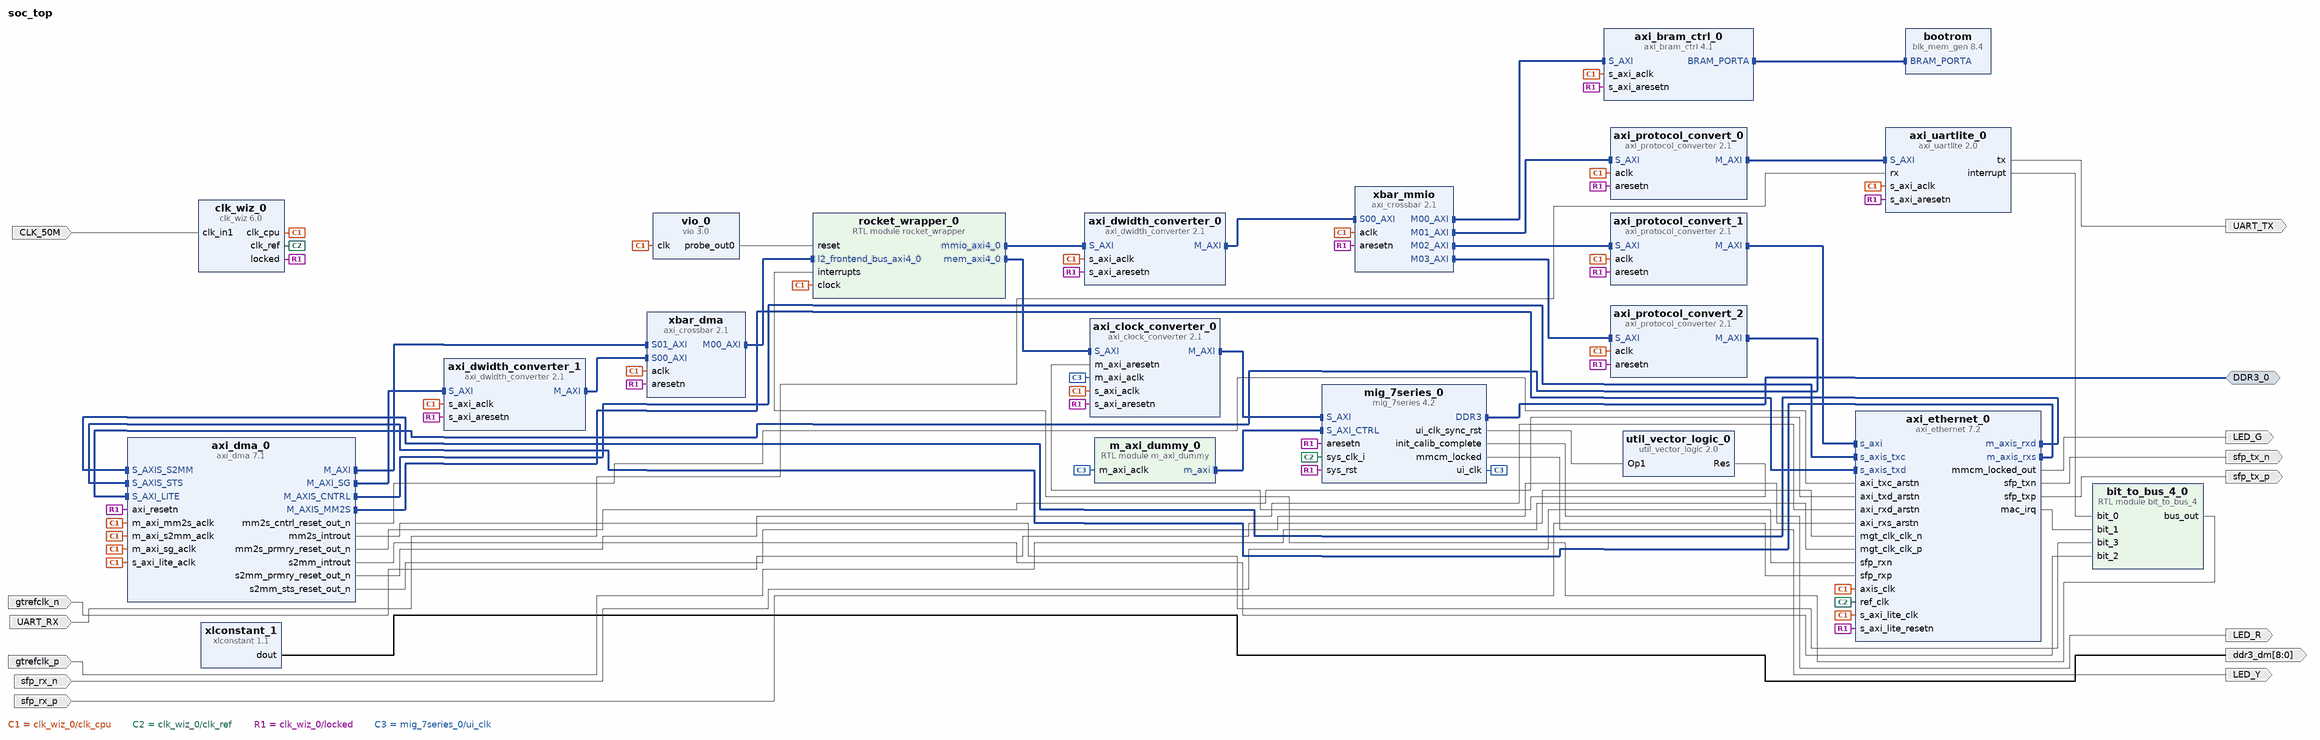
[diagram p0: block diagram of the top level]
# Vivado block design soc_top, xc7k325tffg900-2, Vivado 2021.2.1
create_bd_design soc_top

create_bd_intf_port -mode Master -vlnv xilinx.com:interface:ddrx_rtl:1.0 DDR3_0
create_bd_port -dir O sfp_tx_p
create_bd_port -dir O sfp_tx_n
create_bd_port -dir I sfp_rx_p
create_bd_port -dir I sfp_rx_n
create_bd_port -dir I -type clk gtrefclk_p
set_property -dict {CONFIG.FREQ_HZ 125000000} [get_bd_ports gtrefclk_p]
create_bd_port -dir I -type clk gtrefclk_n
set_property -dict {CONFIG.FREQ_HZ 125000000} [get_bd_ports gtrefclk_n]
create_bd_port -dir O LED_R
create_bd_port -dir O LED_Y
create_bd_port -dir O LED_G
create_bd_port -dir I -type clk CLK_50M
set_property -dict {CONFIG.FREQ_HZ 50000000} [get_bd_ports CLK_50M]
create_bd_port -dir I UART_RX
create_bd_port -dir O UART_TX
create_bd_port -dir O -from 8 -to 0 ddr3_dm

create_bd_cell -type ip -vlnv xilinx.com:ip:axi_ethernet:7.2 axi_ethernet_0
set_property -dict [list \
  CONFIG.Frame_Filter true \
  CONFIG.PHY_TYPE 1000BaseX \
  CONFIG.Statistics_Counters true \
  CONFIG.axiliteclkrate 100 \
  CONFIG.axisclkrate 100 \
  CONFIG.processor_mode true \
] [get_bd_cells axi_ethernet_0]
create_bd_cell -type ip -vlnv xilinx.com:ip:clk_wiz:6.0 clk_wiz_0
set_property -dict [list \
  CONFIG.CLKIN1_JITTER_PS 200.0 \
  CONFIG.CLKOUT1_JITTER 142.107 \
  CONFIG.CLKOUT1_PHASE_ERROR 164.985 \
  CONFIG.CLKOUT1_REQUESTED_OUT_FREQ 200.000 \
  CONFIG.CLKOUT2_JITTER 162.035 \
  CONFIG.CLKOUT2_PHASE_ERROR 164.985 \
  CONFIG.CLKOUT2_REQUESTED_OUT_FREQ 100 \
  CONFIG.CLKOUT2_USED true \
  CONFIG.CLK_OUT1_PORT clk_ref \
  CONFIG.CLK_OUT2_PORT clk_cpu \
  CONFIG.MMCM_CLKFBOUT_MULT_F 20.000 \
  CONFIG.MMCM_CLKIN1_PERIOD 20.000 \
  CONFIG.MMCM_CLKIN2_PERIOD 10.0 \
  CONFIG.MMCM_CLKOUT0_DIVIDE_F 5.000 \
  CONFIG.MMCM_CLKOUT1_DIVIDE 10 \
  CONFIG.NUM_OUT_CLKS 2 \
  CONFIG.PRIM_IN_FREQ 50 \
  CONFIG.USE_RESET false \
] [get_bd_cells clk_wiz_0]
create_bd_cell -type ip -vlnv xilinx.com:ip:axi_clock_converter:2.1 axi_clock_converter_0
create_bd_cell -type ip -vlnv xilinx.com:ip:axi_crossbar:2.1 xbar_mmio
set_property -dict {CONFIG.DATA_WIDTH 32 CONFIG.NUM_MI 4} [get_bd_cells xbar_mmio]
create_bd_cell -type ip -vlnv xilinx.com:ip:axi_bram_ctrl:4.1 axi_bram_ctrl_0
set_property -dict {CONFIG.DATA_WIDTH 32 CONFIG.SINGLE_PORT_BRAM 1} [get_bd_cells axi_bram_ctrl_0]
create_bd_cell -type ip -vlnv xilinx.com:ip:axi_uartlite:2.0 axi_uartlite_0
set_property -dict {CONFIG.C_BAUDRATE 115200} [get_bd_cells axi_uartlite_0]
create_bd_cell -type ip -vlnv xilinx.com:ip:axi_dma:7.1 axi_dma_0
set_property -dict [list \
  CONFIG.c_addr_width 32 \
  CONFIG.c_include_mm2s_dre 1 \
  CONFIG.c_include_s2mm_dre 1 \
  CONFIG.c_m_axi_mm2s_data_width 64 \
  CONFIG.c_m_axi_s2mm_data_width 64 \
  CONFIG.c_mm2s_burst_size 8 \
  CONFIG.c_s2mm_burst_size 8 \
  CONFIG.c_single_interface 1 \
] [get_bd_cells axi_dma_0]
create_bd_cell -type ip -vlnv xilinx.com:ip:axi_protocol_converter:2.1 axi_protocol_convert_0
create_bd_cell -type ip -vlnv xilinx.com:ip:axi_protocol_converter:2.1 axi_protocol_convert_1
create_bd_cell -type ip -vlnv xilinx.com:ip:axi_protocol_converter:2.1 axi_protocol_convert_2
create_bd_cell -type ip -vlnv xilinx.com:ip:axi_dwidth_converter:2.1 axi_dwidth_converter_0
create_bd_cell -type ip -vlnv xilinx.com:ip:vio:3.0 vio_0
set_property -dict [list \
  CONFIG.C_NUM_PROBE_IN 0 \
  CONFIG.C_NUM_PROBE_OUT 1 \
  CONFIG.C_PROBE_OUT0_INIT_VAL 0x1 \
  CONFIG.C_PROBE_OUT1_INIT_VAL 0x1 \
] [get_bd_cells vio_0]
create_bd_cell -type ip -vlnv xilinx.com:ip:mig_7series:4.2 mig_7series_0
set_property -dict [list \
  CONFIG.BOARD_MIG_PARAM Custom \
  CONFIG.MIG_DONT_TOUCH_PARAM Custom \
  CONFIG.RESET_BOARD_INTERFACE Custom \
  CONFIG.XML_INPUT_FILE mig_a.prj \
] [get_bd_cells mig_7series_0]
create_bd_cell -type ip -vlnv xilinx.com:ip:util_vector_logic:2.0 util_vector_logic_0
set_property -dict {CONFIG.C_OPERATION not CONFIG.C_SIZE 1} [get_bd_cells util_vector_logic_0]
create_bd_cell -type ip -vlnv xilinx.com:ip:xlconstant:1.1 xlconstant_1
set_property -dict {CONFIG.CONST_VAL 0 CONFIG.CONST_WIDTH 9} [get_bd_cells xlconstant_1]
create_bd_cell -type module -reference m_axi_dummy m_axi_dummy_0
create_bd_cell -type module -reference bit_to_bus_4 bit_to_bus_4_0
create_bd_cell -type ip -vlnv xilinx.com:ip:blk_mem_gen:8.4 bootrom
set_property -dict [list \
  CONFIG.Coe_File ../../../../../../../u-boot/u-boot.coe \
  CONFIG.EN_SAFETY_CKT false \
  CONFIG.Enable_32bit_Address true \
  CONFIG.Fill_Remaining_Memory_Locations true \
  CONFIG.Load_Init_File true \
  CONFIG.Read_Width_A 32 \
  CONFIG.Register_PortA_Output_of_Memory_Primitives false \
  CONFIG.Use_RSTA_Pin true \
  CONFIG.Write_Depth_A 65536 \
  CONFIG.Write_Width_A 32 \
  CONFIG.use_bram_block Stand_Alone \
] [get_bd_cells bootrom]
create_bd_cell -type module -reference rocket_wrapper rocket_wrapper_0
create_bd_cell -type ip -vlnv xilinx.com:ip:axi_dwidth_converter:2.1 axi_dwidth_converter_1
create_bd_cell -type ip -vlnv xilinx.com:ip:axi_crossbar:2.1 xbar_dma
set_property -dict [list \
  CONFIG.ADDR_RANGES 1 \
  CONFIG.DATA_WIDTH 64 \
  CONFIG.M00_A00_ADDR_WIDTH 32 \
  CONFIG.M00_A00_BASE_ADDR 0x0000000000000000 \
  CONFIG.NUM_MI 1 \
  CONFIG.NUM_SI 2 \
] [get_bd_cells xbar_dma]

# ---- connections ----

connect_bd_intf_net [get_bd_intf_pins axi_bram_ctrl_0/BRAM_PORTA] [get_bd_intf_pins bootrom/BRAM_PORTA]
connect_bd_intf_net [get_bd_intf_pins mig_7series_0/S_AXI] [get_bd_intf_pins axi_clock_converter_0/M_AXI]
connect_bd_intf_net [get_bd_intf_pins axi_dma_0/M_AXI] [get_bd_intf_pins xbar_dma/S01_AXI]
connect_bd_intf_net [get_bd_intf_pins axi_dma_0/M_AXIS_CNTRL] [get_bd_intf_pins axi_ethernet_0/s_axis_txc]
connect_bd_intf_net [get_bd_intf_pins axi_dma_0/M_AXIS_MM2S] [get_bd_intf_pins axi_ethernet_0/s_axis_txd]
connect_bd_intf_net [get_bd_intf_pins axi_dma_0/M_AXI_SG] [get_bd_intf_pins axi_dwidth_converter_1/S_AXI]
connect_bd_intf_net [get_bd_intf_pins xbar_mmio/S00_AXI] [get_bd_intf_pins axi_dwidth_converter_0/M_AXI]
connect_bd_intf_net [get_bd_intf_pins axi_dwidth_converter_1/M_AXI] [get_bd_intf_pins xbar_dma/S00_AXI]
connect_bd_intf_net [get_bd_intf_pins axi_dma_0/S_AXIS_S2MM] [get_bd_intf_pins axi_ethernet_0/m_axis_rxd]
connect_bd_intf_net [get_bd_intf_pins axi_ethernet_0/m_axis_rxs] [get_bd_intf_pins axi_dma_0/S_AXIS_STS]
connect_bd_intf_net [get_bd_intf_pins axi_protocol_convert_0/M_AXI] [get_bd_intf_pins axi_uartlite_0/S_AXI]
connect_bd_intf_net [get_bd_intf_pins axi_protocol_convert_1/M_AXI] [get_bd_intf_pins axi_ethernet_0/s_axi]
connect_bd_intf_net [get_bd_intf_pins axi_protocol_convert_2/M_AXI] [get_bd_intf_pins axi_dma_0/S_AXI_LITE]
connect_bd_intf_net [get_bd_intf_pins m_axi_dummy_0/m_axi] [get_bd_intf_pins mig_7series_0/S_AXI_CTRL]
connect_bd_intf_net [get_bd_intf_ports DDR3_0] [get_bd_intf_pins mig_7series_0/DDR3]
connect_bd_intf_net [get_bd_intf_pins rocket_wrapper_0/mem_axi4_0] [get_bd_intf_pins axi_clock_converter_0/S_AXI]
connect_bd_intf_net [get_bd_intf_pins axi_dwidth_converter_0/S_AXI] [get_bd_intf_pins rocket_wrapper_0/mmio_axi4_0]
connect_bd_intf_net [get_bd_intf_pins xbar_dma/M00_AXI] [get_bd_intf_pins rocket_wrapper_0/l2_frontend_bus_axi4_0]
connect_bd_intf_net [get_bd_intf_pins axi_bram_ctrl_0/S_AXI] [get_bd_intf_pins xbar_mmio/M00_AXI]
connect_bd_intf_net [get_bd_intf_pins axi_protocol_convert_0/S_AXI] [get_bd_intf_pins xbar_mmio/M01_AXI]
connect_bd_intf_net [get_bd_intf_pins xbar_mmio/M02_AXI] [get_bd_intf_pins axi_protocol_convert_1/S_AXI]
connect_bd_intf_net [get_bd_intf_pins xbar_mmio/M03_AXI] [get_bd_intf_pins axi_protocol_convert_2/S_AXI]
connect_bd_net [get_bd_ports CLK_50M] [get_bd_pins clk_wiz_0/clk_in1]
connect_bd_net [get_bd_pins axi_dma_0/mm2s_cntrl_reset_out_n] [get_bd_pins axi_ethernet_0/axi_txc_arstn]
connect_bd_net [get_bd_pins axi_dma_0/mm2s_introut] [get_bd_pins bit_to_bus_4_0/bit_3]
connect_bd_net [get_bd_pins axi_dma_0/mm2s_prmry_reset_out_n] [get_bd_pins axi_ethernet_0/axi_txd_arstn]
connect_bd_net [get_bd_pins axi_dma_0/s2mm_introut] [get_bd_pins bit_to_bus_4_0/bit_2]
connect_bd_net [get_bd_pins axi_dma_0/s2mm_prmry_reset_out_n] [get_bd_pins axi_ethernet_0/axi_rxd_arstn]
connect_bd_net [get_bd_pins axi_dma_0/s2mm_sts_reset_out_n] [get_bd_pins axi_ethernet_0/axi_rxs_arstn]
connect_bd_net [get_bd_pins axi_ethernet_0/mac_irq] [get_bd_pins bit_to_bus_4_0/bit_1]
connect_bd_net [get_bd_pins axi_ethernet_0/mmcm_locked_out] [get_bd_ports LED_G]
connect_bd_net [get_bd_pins axi_ethernet_0/sfp_txn] [get_bd_ports sfp_tx_n]
connect_bd_net [get_bd_pins axi_ethernet_0/sfp_txp] [get_bd_ports sfp_tx_p]
connect_bd_net [get_bd_pins axi_uartlite_0/interrupt] [get_bd_pins bit_to_bus_4_0/bit_0]
connect_bd_net [get_bd_pins axi_uartlite_0/tx] [get_bd_ports UART_TX]
connect_bd_net [get_bd_pins bit_to_bus_4_0/bus_out] [get_bd_pins rocket_wrapper_0/interrupts]
connect_bd_net [get_bd_pins clk_wiz_0/clk_cpu] \
  [get_bd_pins axi_ethernet_0/s_axi_lite_clk] [get_bd_pins axi_bram_ctrl_0/s_axi_aclk] \
  [get_bd_pins axi_uartlite_0/s_axi_aclk] [get_bd_pins axi_dma_0/m_axi_sg_aclk] [get_bd_pins axi_dma_0/m_axi_s2mm_aclk] \
  [get_bd_pins axi_dma_0/m_axi_mm2s_aclk] [get_bd_pins axi_ethernet_0/axis_clk] [get_bd_pins axi_dma_0/s_axi_lite_aclk] \
  [get_bd_pins axi_protocol_convert_0/aclk] [get_bd_pins axi_protocol_convert_2/aclk] \
  [get_bd_pins axi_protocol_convert_1/aclk] [get_bd_pins xbar_mmio/aclk] [get_bd_pins axi_dwidth_converter_0/s_axi_aclk] \
  [get_bd_pins axi_clock_converter_0/s_axi_aclk] [get_bd_pins vio_0/clk] [get_bd_pins rocket_wrapper_0/clock] \
  [get_bd_pins axi_dwidth_converter_1/s_axi_aclk] [get_bd_pins xbar_dma/aclk]
connect_bd_net [get_bd_pins clk_wiz_0/clk_ref] [get_bd_pins axi_ethernet_0/ref_clk] [get_bd_pins mig_7series_0/sys_clk_i]
connect_bd_net [get_bd_pins clk_wiz_0/locked] \
  [get_bd_pins axi_clock_converter_0/s_axi_aresetn] [get_bd_pins axi_bram_ctrl_0/s_axi_aresetn] \
  [get_bd_pins xbar_mmio/aresetn] [get_bd_pins axi_uartlite_0/s_axi_aresetn] [get_bd_pins axi_dma_0/axi_resetn] \
  [get_bd_pins axi_ethernet_0/s_axi_lite_resetn] [get_bd_pins axi_protocol_convert_0/aresetn] \
  [get_bd_pins axi_protocol_convert_2/aresetn] [get_bd_pins axi_protocol_convert_1/aresetn] \
  [get_bd_pins axi_dwidth_converter_0/s_axi_aresetn] [get_bd_pins mig_7series_0/aresetn] [get_bd_pins mig_7series_0/sys_rst] \
  [get_bd_pins axi_dwidth_converter_1/s_axi_aresetn] [get_bd_pins xbar_dma/aresetn]
connect_bd_net [get_bd_ports gtrefclk_n] [get_bd_pins axi_ethernet_0/mgt_clk_clk_n]
connect_bd_net [get_bd_ports gtrefclk_p] [get_bd_pins axi_ethernet_0/mgt_clk_clk_p]
connect_bd_net [get_bd_pins mig_7series_0/init_calib_complete] [get_bd_ports LED_R]
connect_bd_net [get_bd_pins mig_7series_0/mmcm_locked] [get_bd_ports LED_Y]
connect_bd_net [get_bd_pins mig_7series_0/ui_clk] [get_bd_pins axi_clock_converter_0/m_axi_aclk] [get_bd_pins m_axi_dummy_0/m_axi_aclk]
connect_bd_net [get_bd_pins mig_7series_0/ui_clk_sync_rst] [get_bd_pins util_vector_logic_0/Op1]
connect_bd_net -net rx_0_1 [get_bd_ports UART_RX] [get_bd_pins axi_uartlite_0/rx]
connect_bd_net [get_bd_ports sfp_rx_n] [get_bd_pins axi_ethernet_0/sfp_rxn]
connect_bd_net [get_bd_ports sfp_rx_p] [get_bd_pins axi_ethernet_0/sfp_rxp]
connect_bd_net [get_bd_pins util_vector_logic_0/Res] [get_bd_pins axi_clock_converter_0/m_axi_aresetn]
connect_bd_net [get_bd_pins vio_0/probe_out0] [get_bd_pins rocket_wrapper_0/reset]
connect_bd_net [get_bd_pins xlconstant_1/dout] [get_bd_ports ddr3_dm]

# ---- address map ----
assign_bd_address -offset 0x00000000 -range 4G -target_address_space [get_bd_addr_spaces axi_dma_0/Data] [get_bd_addr_segs rocket_wrapper_0/l2_frontend_bus_axi4_0/reg0]
assign_bd_address -offset 0x00000000 -range 4G -target_address_space [get_bd_addr_spaces axi_dma_0/Data_MM2S] [get_bd_addr_segs rocket_wrapper_0/l2_frontend_bus_axi4_0/reg0]
assign_bd_address -offset 0x00000000 -range 4G -target_address_space [get_bd_addr_spaces axi_dma_0/Data_S2MM] [get_bd_addr_segs rocket_wrapper_0/l2_frontend_bus_axi4_0/reg0]
assign_bd_address -offset 0x00000000 -range 4G -target_address_space [get_bd_addr_spaces axi_dma_0/Data_SG] [get_bd_addr_segs rocket_wrapper_0/l2_frontend_bus_axi4_0/reg0]
assign_bd_address -offset 0x80000000 -range 1M -target_address_space [get_bd_addr_spaces m_axi_dummy_0/m_axi] [get_bd_addr_segs mig_7series_0/s_axi_ctrl_memmap/s_axi_ctrl_memaddr]
assign_bd_address -offset 0x80000000 -range 2G -target_address_space [get_bd_addr_spaces rocket_wrapper_0/mem_axi4_0] [get_bd_addr_segs mig_7series_0/memmap/memaddr]
assign_bd_address -offset 0x60000000 -range 1M -target_address_space [get_bd_addr_spaces rocket_wrapper_0/mmio_axi4_0] [get_bd_addr_segs axi_bram_ctrl_0/S_AXI/Mem0]
assign_bd_address -offset 0x60100000 -range 1M -target_address_space [get_bd_addr_spaces rocket_wrapper_0/mmio_axi4_0] [get_bd_addr_segs axi_uartlite_0/S_AXI/Reg]
assign_bd_address -offset 0x60200000 -range 1M -target_address_space [get_bd_addr_spaces rocket_wrapper_0/mmio_axi4_0] [get_bd_addr_segs axi_ethernet_0/s_axi/Reg0]
assign_bd_address -offset 0x60300000 -range 1M -target_address_space [get_bd_addr_spaces rocket_wrapper_0/mmio_axi4_0] [get_bd_addr_segs axi_dma_0/S_AXI_LITE/Reg]

validate_bd_design
save_bd_design
